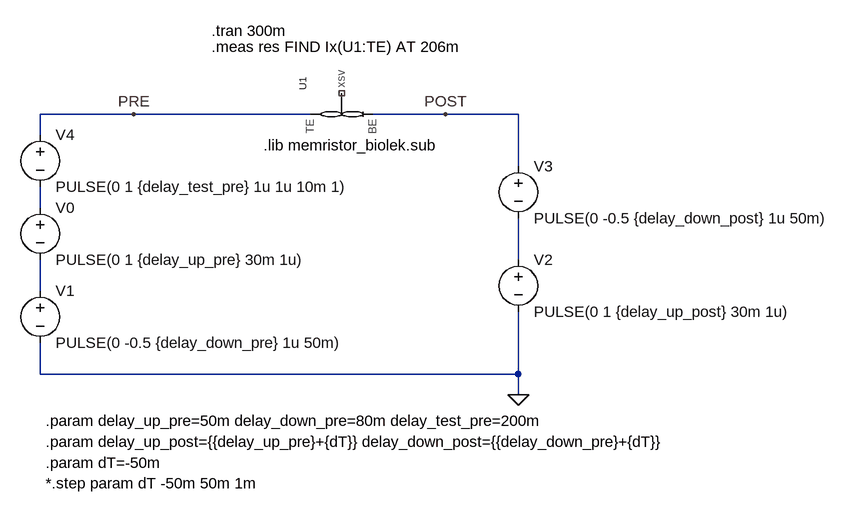
[diagram p0: schematic exp-1_2_c1.asc]
exp-1_2_c1.asc, the LTspice schematic file:
Version 4
SHEET 1 3028 680
WIRE 224 -16 80 -16
WIRE 496 -16 224 -16
WIRE 704 -16 592 -16
WIRE 816 -16 704 -16
WIRE 80 16 80 -16
WIRE 816 64 816 -16
WIRE 80 128 80 96
WIRE 816 208 816 144
WIRE 80 256 80 208
WIRE 80 384 80 336
WIRE 816 384 816 288
WIRE 816 384 80 384
WIRE 816 416 816 384
FLAG 224 -16 PRE
FLAG 816 416 0
FLAG 704 -16 POST
SYMBOL voltage 80 112 R0
WINDOW 123 0 0 Left 0
WINDOW 39 0 0 Left 0
SYMATTR InstName V0
SYMATTR Value PULSE(0 1 {delay_up_pre} 30m 1u)
SYMBOL voltage 80 240 R0
WINDOW 123 0 0 Left 0
WINDOW 39 0 0 Left 0
SYMATTR InstName V1
SYMATTR Value PULSE(0 -0.5 {delay_down_pre} 1u 50m)
SYMBOL voltage 80 0 R0
WINDOW 123 0 0 Left 0
WINDOW 39 0 0 Left 0
SYMATTR InstName V4
SYMATTR Value PULSE(0 1 {delay_test_pre} 1u 1u 10m 1)
SYMBOL voltage 816 48 R0
WINDOW 123 0 0 Left 0
WINDOW 39 0 0 Left 0
SYMATTR InstName V3
SYMATTR Value PULSE(0 -0.5 {delay_down_post} 1u 50m)
SYMBOL voltage 816 192 R0
WINDOW 123 0 0 Left 0
WINDOW 39 0 0 Left 0
SYMATTR InstName V2
SYMATTR Value PULSE(0 1 {delay_up_post} 30m 1u)
SYMBOL memristor_with_state 544 -16 R270
SYMATTR InstName U1
SYMATTR Value MEM_BIOLEK_WILLIAN
TEXT 344 -144 Left 2 !.tran 300m
TEXT 88 456 Left 2 !.param delay_up_pre=50m delay_down_pre=80m delay_test_pre=200m
TEXT 88 488 Left 2 !.param delay_up_post={{delay_up_pre}+{dT}} delay_down_post={{delay_down_pre}+{dT}}
TEXT 88 520 Left 2 !.param dT=-50m
TEXT 88 552 Left 2 !*.step param dT -50m 50m 1m
TEXT 344 -120 Left 2 !.meas res FIND Ix(U1:TE) AT 206m
TEXT 424 32 Left 2 !.lib memristor_biolek.sub

The netlist it stands for:
* exp-1_2_c1.asc
V0 N001 N003 PULSE(0 1 {delay_up_pre} 30m 1u)
V1 N003 0 PULSE(0 -0.5 {delay_down_pre} 1u 50m)
V4 PRE N001 PULSE(0 1 {delay_test_pre} 1u 1u 10m 1)
V3 POST N002 PULSE(0 -0.5 {delay_down_post} 1u 50m)
V2 N002 0 PULSE(0 1 {delay_up_post} 30m 1u)
XU1 PRE POST NC_01 MEM_BIOLEK_WILLIAN  ; pins TE BE xsv
.tran 300m
.param delay_up_pre=50m delay_down_pre=80m delay_test_pre=200m
.param delay_up_post={{delay_up_pre}+{dT}} delay_down_post={{delay_down_pre}+{dT}}
.param dT=-50m
*.step param dT -50m 50m 1m
.meas res FIND Ix(U1:TE) AT 206m
.lib memristor_biolek.sub
.backanno
.end